# EAGLE schematic programmer (EAGLE 7.5.0)

## Sheet 1 of 2
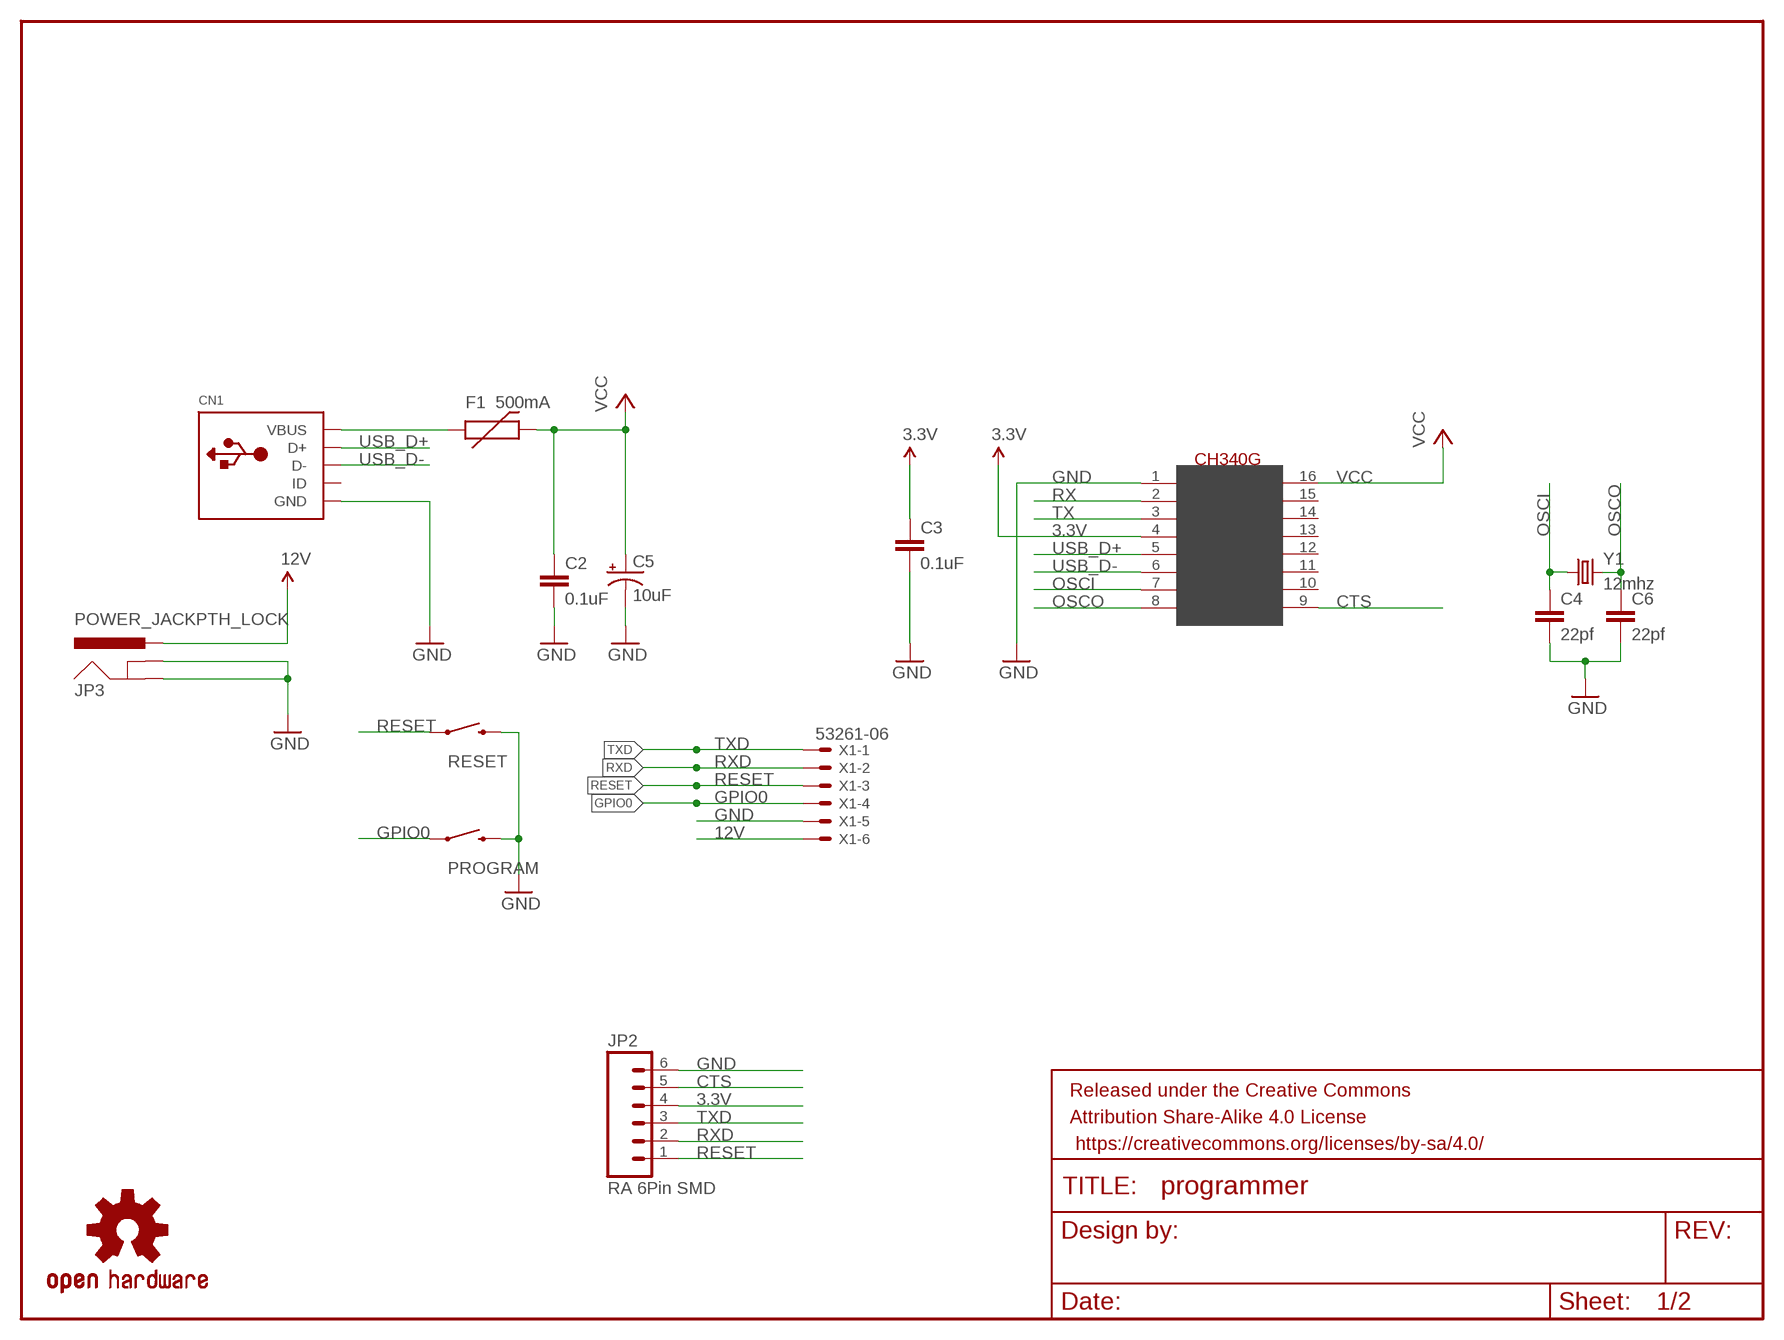
[diagram p0: schematic, sheet 1]

### Parts
C2  0.1uF  CAP1206  [1206]
C3  0.1uF  C-EUC1206K  [C1206K]
C4  22pf  CAP1206  [1206]
C5  10uF  10UF-16V-10%(TANT)  [EIA3216]
C6  22pf  CAP1206  [1206]
CN1  USBMINIB  [USB-MINIB]
F1  500mA  PTCSMD  [PTC-1206]
FRAME1  FRAME-LETTERNO_PACKAGE  [DUMMY]
JP2  RA 6Pin SMD  M06SMD  [1X06-SMD]
JP3  POWER_JACKPTH_LOCK  [POWER_JACK_PTH_LOCK]
LOGO1  OSHW-LOGOS  [OSHW-LOGO-S]
PROGRAM  SWITCH-MOMENTARY-2PTH  [TACTILE-PTH]
RESET  SWITCH-MOMENTARY-2PTH  [TACTILE-PTH]
U$1  CH340G  [SOIC16]
X1  53261-06  [53261-06]
Y1  12mhz  CRYSTALSMD  [HC49UP]

### Nets
3.3V: C3.1 JP2.4 U$1.4(V3)
12V: JP3.PWR X1.6
CTS: JP2.5 U$1.9(CTS)
GND: C2.2 C3.2 C4.2 C5.C(-) C6.2 CN1.GND JP2.6 JP3.GND JP3.GNDBREAK PROGRAM.3 RESET.3 U$1.1(GND) X1.5
GPIO0: PROGRAM.1 X1.4
N$3: CN1.VBUS F1.1
OSCI: C4.1 U$1.7(XI) Y1.1
OSCO: C6.1 U$1.8(XO) Y1.2
RESET: JP2.1 RESET.1 X1.3
RX: U$1.2(TX)
RXD: JP2.2 X1.2
TX: U$1.3(RX)
TXD: JP2.3 X1.1
USB_D+: CN1.D+ U$1.5(D+)
USB_D-: CN1.D- U$1.6(D-)
VCC [power]: C2.1 C5.A(+) F1.2 U$1.16(VCC)
Unconnected: CN1.ID U$1.10(DSR) U$1.11(RI) U$1.12(DCD) U$1.13(DTR) U$1.14(RTS) U$1.15(RS232)

## Sheet 2 of 2

## Library data of the parts
C2 = SparkFun-Passives:CAP: Capacitor Standard 0603 ceramic capacitor, and 0.1" leaded capacitor.
C3 = rcl:C-EU: CAPACITOR, European symbol
C4 C6 = SparkFun-Capacitors:CAP: Capacitor Standard 0603 ceramic capacitor, and 0.1" leaded capacitor.
C5 = SparkFun-Capacitors:10UF-16V-10%(TANT): CAP-00811 1206/EIA-3216 Tantalum capacitor; PROD_ID: CAP-00811
CN1 = adafruit:USB: USB Connectors USBMINIB - Surface Mount Female Mini-B USB Connector 4UConnector: 06564 By microbuilder.eu Thru-hole RA Female Mini-B USB Connector 4UConnector: 18732 By ladyada.net
F1 = SparkFun:PTC: Resettable Fuse PTC Resettable Fuse. Spark Fun Electronics SKU : COM-08357
FRAME1 = SparkFun-Aesthetics:FRAME-LETTER: Schematic Frame Standard 8.5x11 US Letter frame; DESIGNER: Nobody; VERSION: v01
JP2 = SparkFun-Connectors:M06: Header 6 Standard 6-pin 0.1" header. Use with straight break away headers (SKU : PRT-00116), right angle break away headers (PRT-00553), swiss pins (PRT-00743), machine pins (PRT-00117), and female headers (PRT-00115). Molex polarized connector foot print use with SKU : PRT-08094 with associated crimp pins and housings. NOTES ON THE VARIANTS LOCK and LOCK_LONGPADS... This footprint was designed to help hold the alignment of a through-hole component (i.e. 6-pin header) while soldering it into place. You may notice that each hole has been shifted either up or down by 0.005 of an inch from it's more standard position (which is a perfectly straight line). This slight alteration caused the pins (the squares in the middle) to touch the edges of the holes. Because they are alternating, it causes a "brace" to hold the component in place. 0.005 has proven to be the perfect amount of "off-center" position when using our standard breakaway headers. Although looks a little odd when you look at the bare footprint, once you have a header in there, the alteration is very hard to notice. Also,if you push a header all the way into place, it is covered up entirely on the bottom side. This idea of altering the position of holes to aid alignment will be further integrated into the Sparkfun Library for other footprints. It can help hold any component with 3 or more connection pins.; PROD_ID: CONN-08971
JP3 = SparkFun-Connectors:POWER_JACK: Power Jack This is the standard 5.5mm barrel jack for power. The PTH is the most common, proven, reliable, footprint. The Slot footprint only works if the mill layer is transmitted to the PCB fab house so be warned. Mating wall wart : TOL-00298 (and others); PROD_ID: CONN-08197; SF_ID: PRT-00119
LOGO1 = SparkFun-Aesthetics:OSHW-LOGO: Open Source Hardware Logo This logo indicates the piece of hardware it is found on incorporates a OSHW license and/or adheres to the definition of open source hardware found here: http://freedomdefined.org/OSHW
PROGRAM RESET = SparkFun-Electromechanical:SWITCH-MOMENTARY-2: Various NO switches- pushbuttons, reed, etc
U$1 = CH340G-USB-SERIAL:CH340G
X1 = con-molex:53?-06: CONNECTOR wire to board 1.25 mm (.049 inch) pitch header; OC_FARNELL: 1125375; OC_NEWARK: unknown
Y1 = SparkFun-FreqCtrl:CRYSTAL: Various standard crystals. Proven footprints.

## Net classes
1 power: width 0.254 mm